# EasyEDA schematic A1_SIMPLE_IO_v0.93_SCHEMATIC.json
TITLE: Apple-1 I/O Board; REV: 0.93; Date: 2020-02-01; Sheet: 1/1; Drawn By: CP; Company: P-LAB
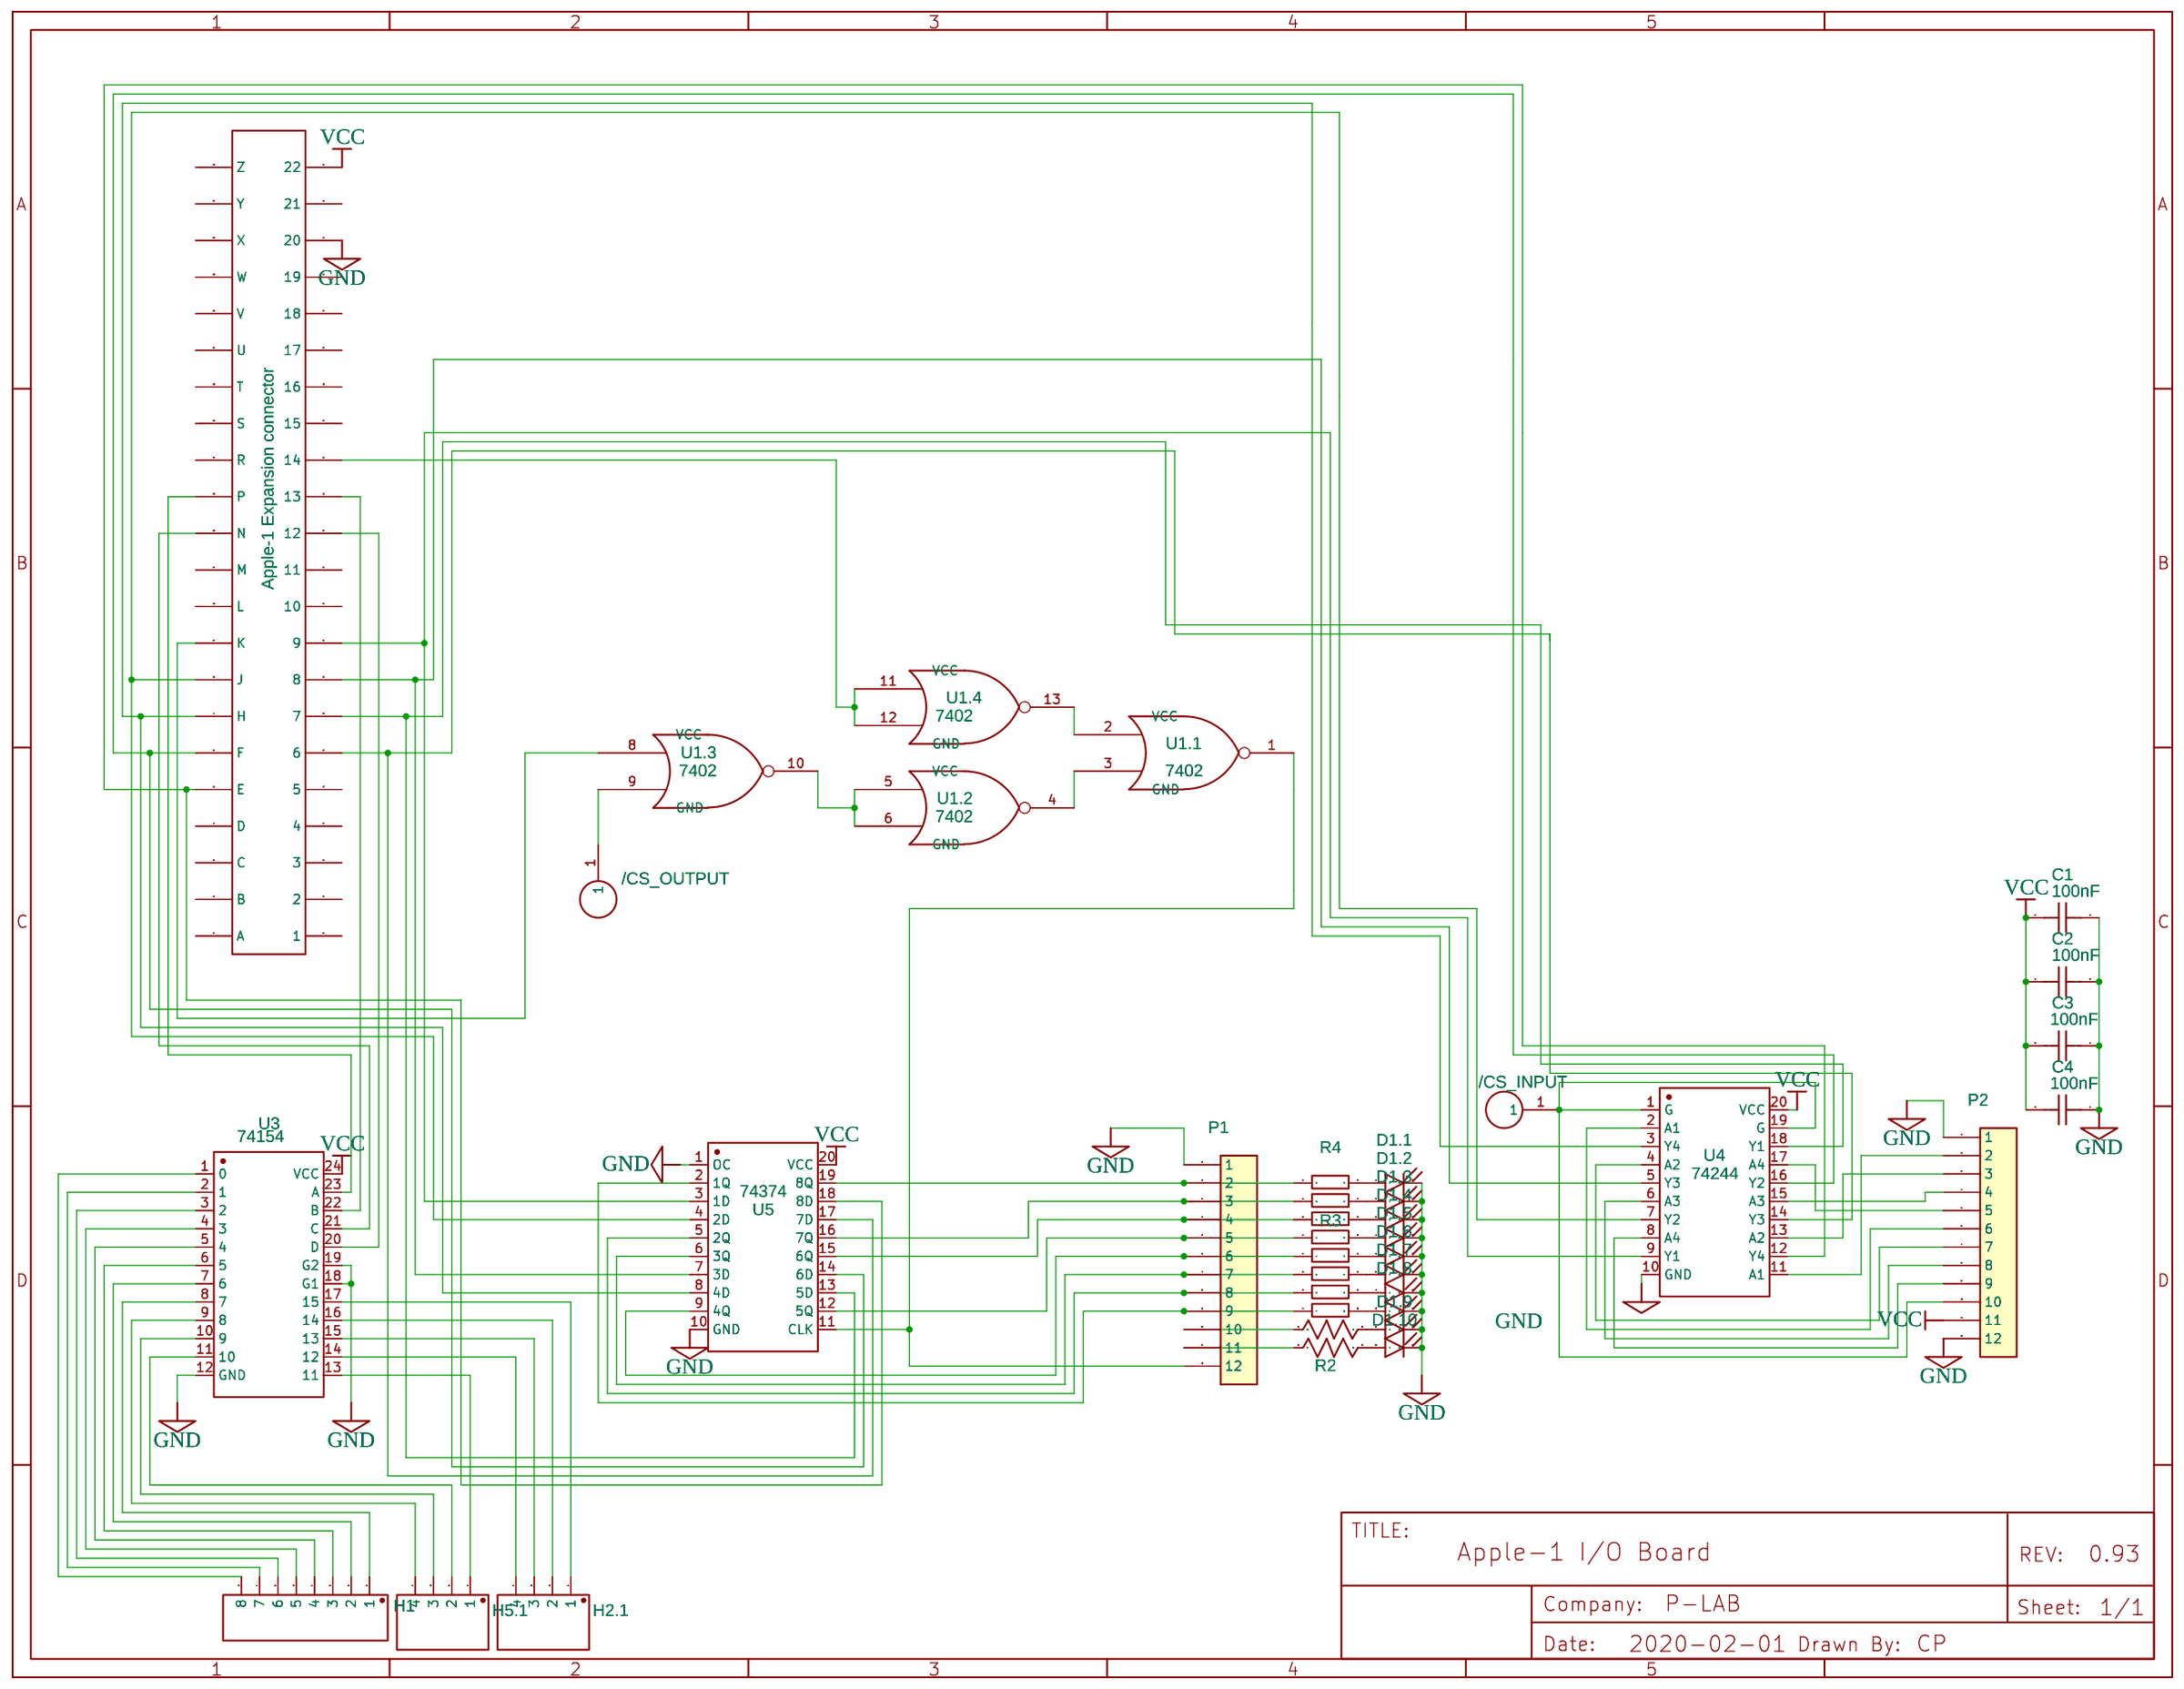
[diagram p0: schematic sheet]

## Parts
/CS_INPUT  through-hole  [THROUGH-HOLE]
/CS_OUTPUT  through-hole  [THROUGH-HOLE]
C1  100nF  [CAP-TH_L4.8-W3.2-P5.08-D1.2]
C2  100nF  [CAP-TH_L4.8-W3.2-P5.08-D1.2]
C3  100nF  [CAP-TH_L4.8-W3.2-P5.08-D1.2]
C4  100nF  [CAP-TH_L4.8-W3.2-P5.08-D1.2]
D1  LED_BARGRAPH_10  [LED_BARGAPH_10]  (sections 1,10,2,3,4,5,6,7,8,9)
H1  Header-Male-2.54_1x8  [210S-1X8P]
H2  Header-Male-2.54_1x4Temp  [210S-1X4P]  (section 1)
H5  Header-Male-2.54_1x4Temp  [210S-1X4P]  (section 1)
J2  Apple-1 Expansion connector  [EDAC_CARD_EDGE_2X22_PIN_3.96]
P1  Header-Female-2.54_1x12  [HDR1X12]
P2  Header-Female-2.54_1x12  [HDR1X12]
R1  1/4W RESISTOR  [AXIAL-6.5X2.3(1/4W)]
R2  1/4W RESISTOR  [AXIAL-6.5X2.3(1/4W)]
R3  ResistorArray4_SIP8  [RESISTOR_ARRAY_SIP_8]
R4  ResistorArray4_SIP8  [RESISTOR_ARRAY_SIP_8]
U1  7402  [DIL-14]  (sections 1,2,3,4)
U3  74154  [DIL-24S]
U4  74244  [DIP20]
U5  74374  [DIP20]

## Library data of the parts
/CS_INPUT /CS_OUTPUT = through-hole: Contributor: deadmanhide
C1-C4 = CT4G-0805-2X1-50V-0.1UF-K: Supplier: LCSC; Supplier Part: C141981; Manufacturer: TORCH; Manufacturer Part: CT4G-0805-2X1-50V-0.1uF-K; Contributor: LCSC
D1 = LED_BARGRAPH_10: 10-Segment LED Bar Graph; Contributor: SparkFun; subpart_no: 1
H1 = Header-Male-2.54_1x8: Supplier: LCSC; Manufacturer: Ckmtw; Manufacturer Part: 210S-1*8P L=11.6MMGold-plated black; Contributor: LCSC; Supplier Part: C124381
H2 H5 = Header-Male-2.54_1x4Temp: Supplier Part: C124378; Supplier: LCSC; Manufacturer: Ckmtw; Manufacturer Part: 210S-1*4P L=11.6MMGold-plated black; Contributor: madHatter; subpart_no: 1
J2 = EDAC_Card_Edge_Female_2x22_pin_3.96mm: Manufacturer Part: 306-018-520-102; Contributor: burek; Package Display: No
P1 P2 = Header-Female-2.54_1x12: EasyEDA: E35445; Supplier Part: E35445; Supplier: EasyEDA; Manufacturer: EasyEDA; Manufacturer Part: Header-Female-2.54_1x10
R1 R2 = 1/4W RESISTOR: Contributor: NashvilleAmps
R3 R4 = ResistorArray4_SIP8: Contributor: robdobsn
U1 = 74LS02: Contributor: Tyool; subpart_no: 1
U3 = SN74154N
U4 = 74244
U5 = 74374

## Nets
GND: C1.2 C2.2 C3.1 C4.1 D1.11(C) D1.12(C) D1.13(C) D1.14(C) D1.15(C) D1.16(C) D1.17(C) D1.18(C) D1.19(C) D1.20(C) J2.42(20) P1.1 P2.1 P2.12 U3.12(GND) U3.18(G1) U3.19(G2) U4.10(GND) U5.1(OC) U5.10(GND)
VCC: C1.1 C2.1 C3.2 C4.2 J2.44(22) P2.11 U3.24(VCC) U4.20(VCC) U5.20(VCC)
Net-(/CS_INPUT-1): /CS_INPUT.1 P2.10 U4.1(G) U4.19(G)
Net-(/CS_OUTPUT-1): /CS_OUTPUT.1 U1.9
Net-(D1.1-1): D1.1(A) R4.2
Net-(D1.2-2): D1.2(A) R4.4
Net-(D1.3-3): D1.3(A) R4.6
Net-(D1.4-4): D1.4(A) R4.8
Net-(D1.5-5): D1.5(A) R3.2
Net-(D1.6-6): D1.6(A) R3.4
Net-(D1.7-7): D1.7(A) R3.6
Net-(D1.8-8): D1.8(A) R3.8
Net-(D1.9-9): D1.9(A) R1.2
Net-(D1.10-10): D1.10(A) R2.2
Net-(H1-1): H1.1 U3.8(7)
Net-(H1-2): H1.2 U3.7(6)
Net-(H1-3): H1.3 U3.6(5)
Net-(H1-4): H1.4 U3.5(4)
Net-(H1-5): H1.5 U3.4(3)
Net-(H1-6): H1.6 U3.3(2)
Net-(H1-7): H1.7 U3.2(1)
Net-(H1-8): H1.8 U3.1(0)
Net-(H2.1-1): H2.1 U3.17(15)
Net-(H2.1-2): H2.2 U3.16(14)
Net-(H2.1-3): H2.3 U3.15(13)
Net-(H2.1-4): H2.4 U3.14(12)
Net-(H5.1-1): H5.1 U3.13(11)
Net-(H5.1-2): H5.2 U3.11(10)
Net-(H5.1-3): H5.3 U3.10(9)
Net-(H5.1-4): H5.4 U3.9(8)
Net-(J2-5): J2.5(E) U4.12(Y4) U5.18(8D)
Net-(J2-6): J2.6(F) U4.16(Y2) U5.14(6D)
Net-(J2-7): J2.7(H) U4.3(Y4) U5.8(4D)
Net-(J2-8): J2.8(J) U4.7(Y2) U5.4(2D)
Net-(J2-9): J2.9(K) U1.8
Net-(J2-12): J2.12(N) U3.21(C)
Net-(J2-13): J2.13(P) U3.23(A)
Net-(J2-28): J2.28(6) U4.14(Y3) U5.17(7D)
Net-(J2-29): J2.29(7) U4.18(Y1) U5.13(5D)
Net-(J2-30): J2.30(8) U4.5(Y3) U5.7(3D)
Net-(J2-31): J2.31(9) U4.9(Y1) U5.3(1D)
Net-(J2-34): J2.34(12) U3.20(D)
Net-(J2-35): J2.35(13) U3.22(B)
Net-(J2-36): J2.36(14) U1.11 U1.12
Net-(P1-2): P1.2 R4.1 U5.19(8Q)
Net-(P1-3): P1.3 R4.3 U5.16(7Q)
Net-(P1-4): P1.4 R4.5 U5.15(6Q)
Net-(P1-5): P1.5 R4.7 U5.12(5Q)
Net-(P1-6): P1.6 R3.1 U5.9(4Q)
Net-(P1-7): P1.7 R3.3 U5.6(3Q)
Net-(P1-8): P1.8 R3.5 U5.5(2Q)
Net-(P1-9): P1.9 R3.7 U5.2(1Q)
Net-(P1-10): P1.10 R1.1
Net-(P1-11): P1.11 R2.1
Net-(P1-12): P1.12 U1.1 U5.11(CLK)
Net-(P2-2): P2.2 U4.11(A1)
Net-(P2-3): P2.3 U4.13(A2)
Net-(P2-4): P2.4 U4.15(A3)
Net-(P2-5): P2.5 U4.17(A4)
Net-(P2-6): P2.6 U4.2(A1)
Net-(P2-7): P2.7 U4.4(A2)
Net-(P2-8): P2.8 U4.6(A3)
Net-(P2-9): P2.9 U4.8(A4)
Net-(U1.1-2): U1.2 U1.13
Net-(U1.1-3): U1.3 U1.4
Net-(U1.2-5): U1.5 U1.6 U1.10

Not connected (* = marked no-connect by the designer): J2 1(A) 2(B) 3(C) 4(D) 10(L) 11(M) 14(R) 15(S) 16(T) 17(U) 18(V) 19(W) 20(X) 21(Y) 22(Z) 23(1) 24(2) 25(3) 26(4) 27(5) 32(10) 33(11) 37(15) 38(16) 39(17) 40(18) 41(19) 43(21); U1 7(GND) 14(VCC)
